# EAGLE design CANode (EAGLE 6.3)
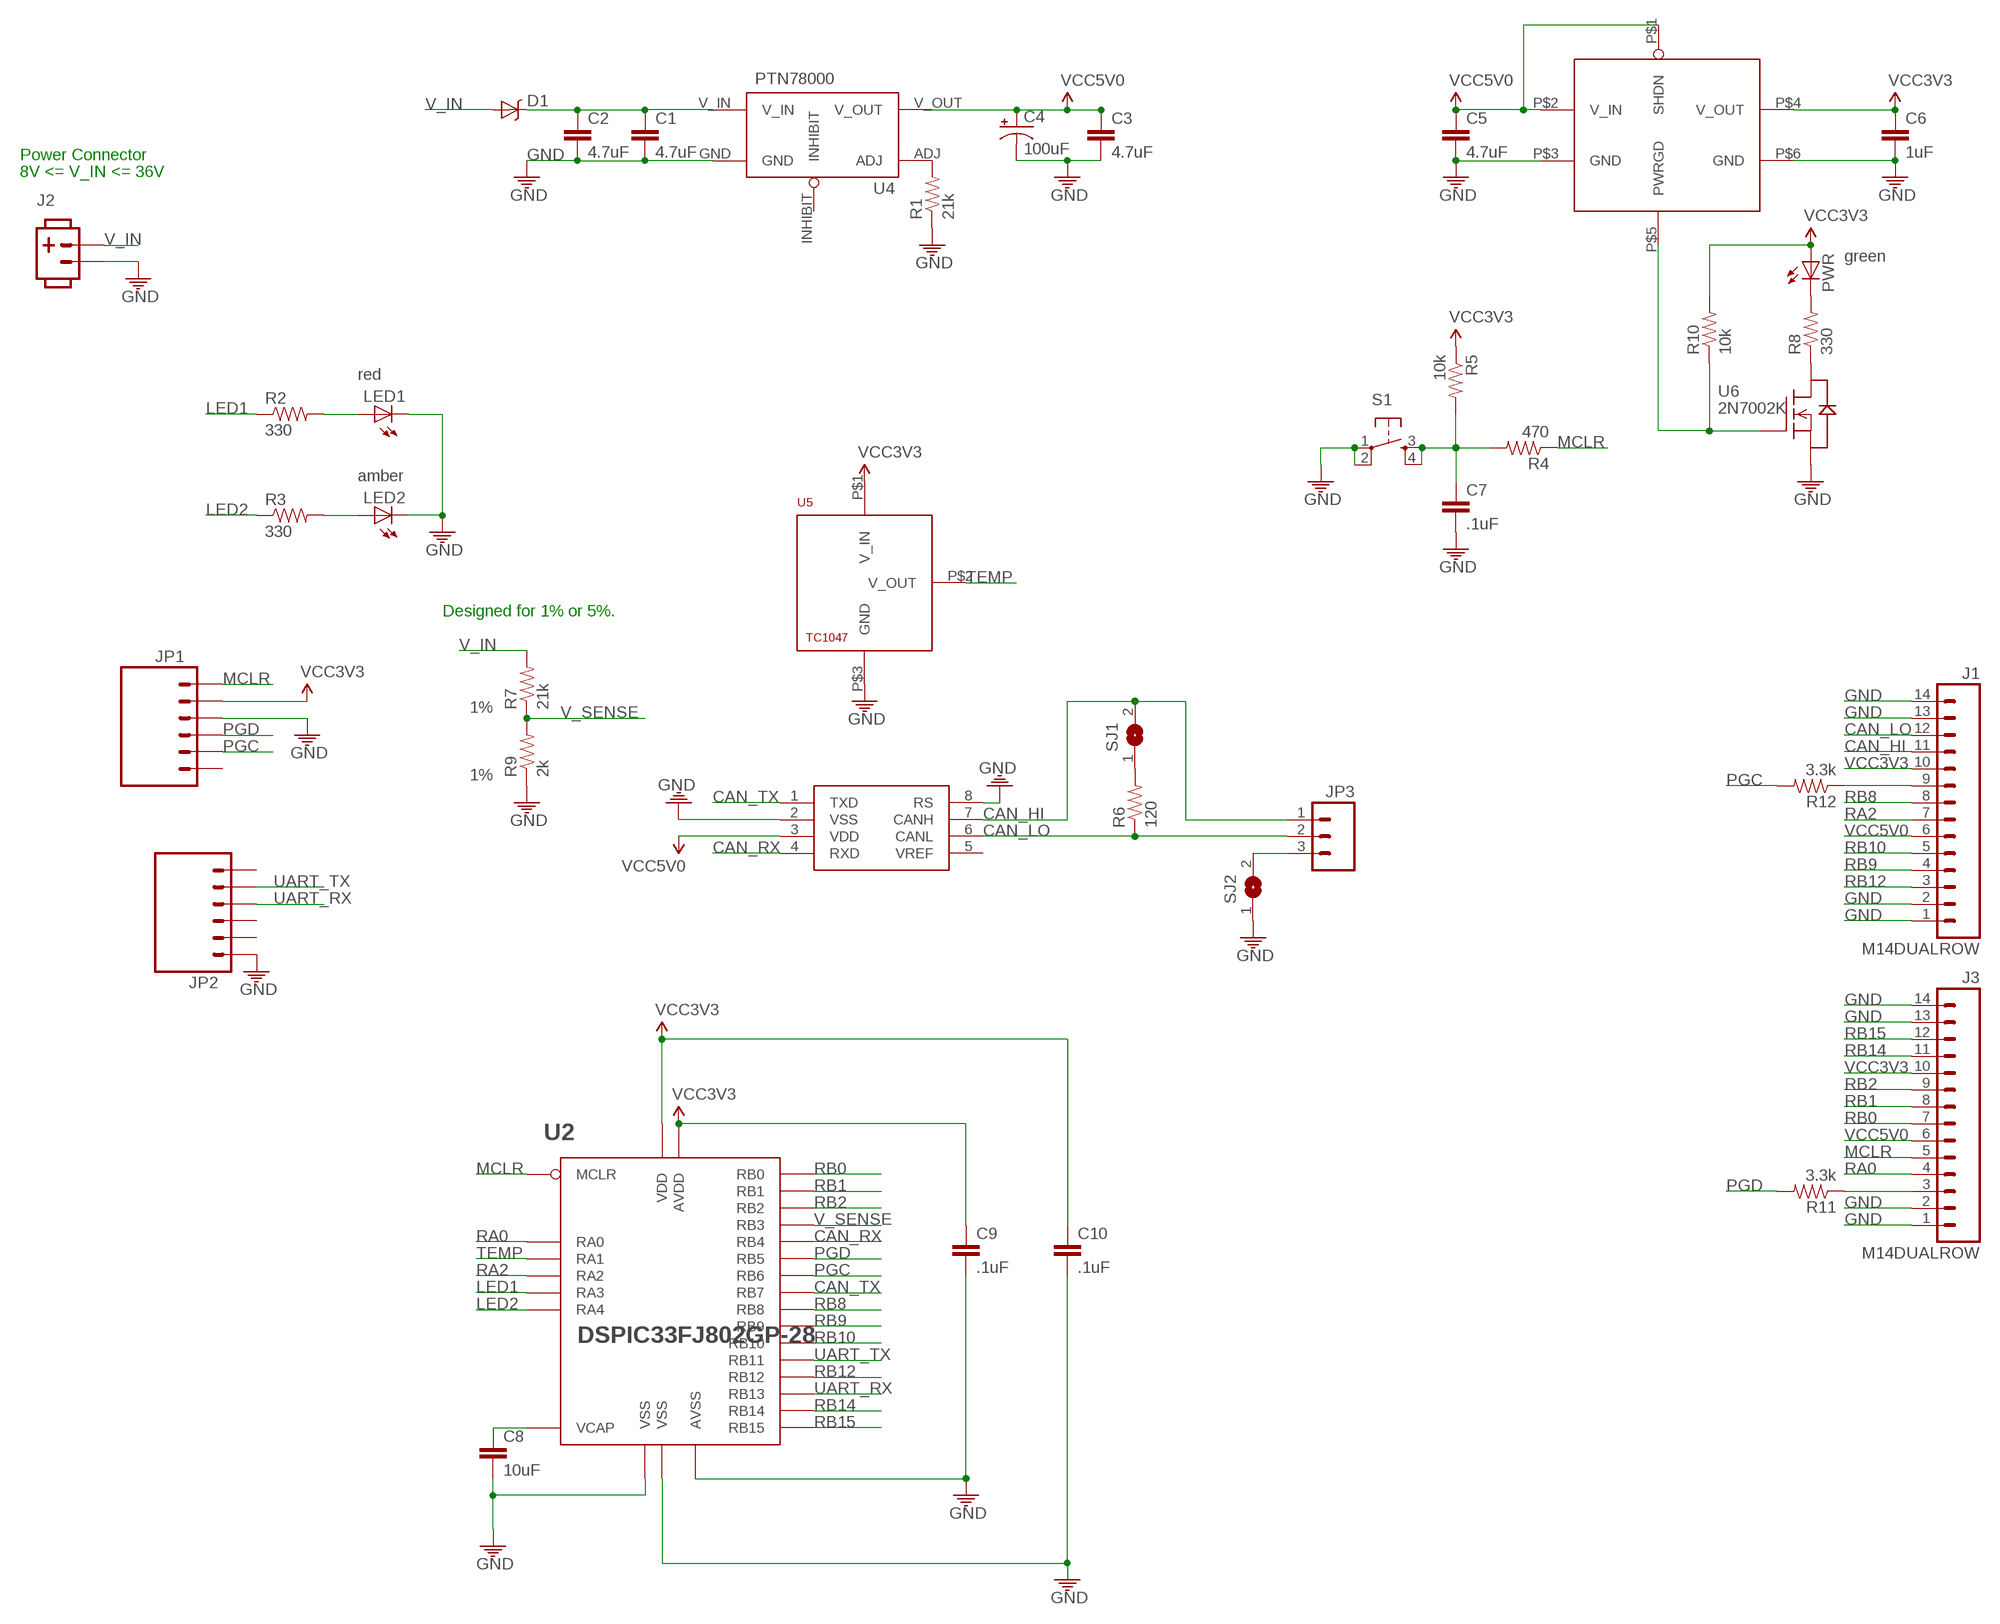
[diagram p0: schematic, sheet 1]

## Parts
C1  4.7uF  CAP1206  [1206]
C2  4.7uF  CAP1206  [1206]
C3  4.7uF  CAP1206  [1206]
C4  100uF  CAP_POLPTH1  [CPOL-RADIAL-100UF-25V]
C5  4.7uF  CAP1206  [1206]
C6  1uF  CAP1206  [1206]
C7  .1uF  CAP1206  [1206]
C8  10uF  CAP1206  [1206]
C9  .1uF  CAP1206  [1206]
C10  .1uF  CAP1206  [1206]
D1  DIODE-SCHOTTKY240A  [SMA-DIODE-B240A]
J1  M14DUALROW  [2X7]
J2  POW_CONNECTMALE-RA  [SOCKET-MALE_RA-3.96MM-2]
J3  M14DUALROW  [2X7]
JP1  M06RA_LOCK  [MOLEX-1X6-RA_LOCK]
JP2  M06LOCK  [1X06_LOCK]
JP3  M03LOCK  [1X03_LOCK]
LED1  LED1206  [LED-1206]
LED2  LED1206  [LED-1206]
PWR  LED1206  [LED-1206]
R1  21k  RESISTOR0805-RES  [0805]
R2  330  RESISTOR0805-RES  [0805]
R3  330  RESISTOR0805-RES  [0805]
R4  470  RESISTOR0805-RES  [0805]
R5  10k  RESISTOR0805-RES  [0805]
R6  120  RESISTOR0805-RES  [0805]
R7  21k  RESISTOR0805-RES  [0805]
R8  330  RESISTOR0805-RES  [0805]
R9  2k  RESISTOR0805-RES  [0805]
R10  10k  RESISTOR0805-RES  [0805]
R11  3.3k  RESISTOR0805-RES  [0805]
R12  3.3k  RESISTOR0805-RES  [0805]
S1  TAC_SWITCHPTH  [B3F-1020]
SJ1  SJ  [SJ]
SJ2  SJ  [SJ]
U1  MCP2551  [SO08]
U2  DSPIC33FJ802GP-28  [SOIC28-W]
U3  MCP1826  [SOT223-5]
U4  PTN78000  PTN78000THROUGH-HOLE  [PTN78000]
U5  TC1047  [SOT-23B]
U6  2N7002K  [SOT23-3]

## Nets
CAN_HI [small]: J1.11 JP3.1 SJ1.2 U1.7(CANH)
CAN_LO [small]: J1.12 JP3.2 R6.1 U1.6(CANL)
CAN_RX: U1.4(RXD) U2.P$11(RB4)
CAN_TX [small]: U1.1(TXD) U2.P$16(RB7)
GND [power]: C1.2 C2.2 C3.2 C4.2(-) C5.2 C6.2 C7.2 C8.2 C9.2 C10.2 J1.1 J1.2 J1.13 J1.14 J2.2 J3.1 J3.2 J3.13 J3.14 JP1.3 JP2.1 LED1.C LED2.C R1.1 R9.1 S1.1 S1.2 SJ2.1 U1.2(VSS) U1.8(RS) U2.P$8(VSS) U2.P$19(VSS) U2.P$27(AVSS) U3.P$3(GND) U3.P$6(GND) U4.GND U5.P$3(GND) U6.2(S)
LED1: R2.1 U2.P$10(RA3)
LED2: R3.1 U2.P$12(RA4)
MCLR [small]: J3.5 JP1.1 R4.1 U2.P$1(MCLR)
N$1 [small]: LED1.A R2.2
N$2: R1.2 U4.ADJ
N$3 [small]: LED2.A R3.2
N$4: R8.1 U6.3(D)
N$5 [power_in]: C1.1 C2.1 D1.C U4.V_IN
N$6 [power]: C7.1 R4.2 R5.2 S1.3 S1.4
N$7: C8.1 U2.P$20(VCAP)
N$8: PWR.C R8.2
N$9: R10.1 U3.P$5(PWRGD) U6.1(G)
N$10: R6.2 SJ1.1
N$11 [small]: J3.3 R11.1
N$12: JP3.3 SJ2.2
N$13 [small]: J1.9 R12.1
PGC [small]: JP1.5 R12.2 U2.P$15(RB6)
PGD [small]: JP1.4 R11.2 U2.P$14(RB5)
RA0: J3.4 U2.P$2(RA0)
RA2 [small]: J1.7 U2.P$9(RA2)
RB0 [small]: J3.7 U2.P$4(RB0)
RB1 [small]: J3.8 U2.P$5(RB1)
RB2 [small]: J3.9 U2.P$6(RB2)
RB8 [small]: J1.8 U2.P$17(RB8)
RB9: J1.4 U2.P$18(RB9)
RB10 [small]: J1.5 U2.P$21(RB10)
RB12 [small]: J1.3 U2.P$23(RB12)
RB14 [small]: J3.11 U2.P$25(RB14)
RB15 [small]: J3.12 U2.P$26(RB15)
TEMP: U2.P$3(RA1) U5.P$2(V_OUT)
UART_RX: JP2.4 U2.P$24(RB13)
UART_TX: JP2.5 U2.P$22(RB11)
V_IN [power_in]: D1.A J2.1 R7.2
V_SENSE: R7.1 R9.2 U2.P$7(RB3)
VCC3V3 [power]: C6.1 C9.1 C10.1 J1.10 J3.10 JP1.2 PWR.A R5.1 R10.2 U2.P$13(VDD) U2.P$28(AVDD) U3.P$4(V_OUT) U5.P$1(V_IN)
VCC5V0 [power]: C3.1 C4.1(+) C5.1 J1.6 J3.6 U1.3(VDD) U3.P$1(SHDN) U3.P$2(V_IN) U4.V_OUT
Unconnected: JP1.6 JP2.2 JP2.3 JP2.6 U1.5(VREF) U4.INHIBIT

## Notes on the sheet
- Power Connector
- 8V <= V_IN <= 36V
- Designed for 1% or 5%.

## Library data of the parts
C1-C3 C5-C10 = CMPE118lib:CAP: Capacitor Standard 0603 ceramic capacitor, and 0.1" leaded capacitor.
C4 = ASL:CAP_POL: Capacitor Polarized These are standard SMD and PTH capacitors. Normally 10uF, 47uF, and 100uF in electrolytic and tantalum varieties. Always verify the external diameter of the through hole cap, it varies with capacity, voltage, and manufacturer. The EIA devices should be standard.
D1 = CMPE118lib:DIODE-SCHOTTKY
J1 J3 = CMPE118lib:M14: Header 14 Standard 14-pin 0.1" header. Use with straight break away headers (SKU : PRT-00116), right angle break away headers (PRT-00553), swiss pins (PRT-00743), machine pins (PRT-00117), and female headers (PRT-00115).
J2 = ASL:POW_CONNECT
JP1 = ASL:M06: Header 6 Standard 6-pin 0.1" header. Use with straight break away headers (SKU : PRT-00116), right angle break away headers (PRT-00553), swiss pins (PRT-00743), machine pins (PRT-00117), and female headers (PRT-00115). Molex polarized connector foot print use with SKU : PRT-08094 with associated crimp pins and housings. NOTES ON THE VARIANTS LOCK and LOCK_LONGPADS... This footprint was designed to help hold the alignment of a through-hole component (i.e. 6-pin header) while soldering it into place. You may notice that each hole has been shifted either up or down by 0.005 of an inch from it's more standard position (which is a perfectly straight line). This slight alteration caused the pins (the squares in the middle) to touch the edges of the holes. Because they are alternating, it causes a "brace" to hold the component in place. 0.005 has proven to be the perfect amount of "off-center" position when using our standard breakaway headers. Although looks a little odd when you look at the bare footprint, once you have a header in there, the alteration is very hard to notice. Also, if you push a header all the way into place, it is covered up entirely on the bottom side. This idea of altering the position of holes to aid alignment will be further integrated into the Sparkfun Library for other footprints. It can help hold any component with 3 or more connection pins.
JP2 = CMPE118lib:M06: Header 6 Standard 6-pin 0.1" header. Use with straight break away headers (SKU : PRT-00116), right angle break away headers (PRT-00553), swiss pins (PRT-00743), machine pins (PRT-00117), and female headers (PRT-00115). Molex polarized connector foot print use with SKU : PRT-08094 with associated crimp pins and housings. NOTES ON THE VARIANTS LOCK and LOCK_LONGPADS... This footprint was designed to help hold the alignment of a through-hole component (i.e. 6-pin header) while soldering it into place. You may notice that each hole has been shifted either up or down by 0.005 of an inch from it's more standard position (which is a perfectly straight line). This slight alteration caused the pins (the squares in the middle) to touch the edges of the holes. Because they are alternating, it causes a "brace" to hold the component in place. 0.005 has proven to be the perfect amount of "off-center" position when using our standard breakaway headers. Although looks a little odd when you look at the bare footprint, once you have a header in there, the alteration is very hard to notice. Also, if you push a header all the way into place, it is covered up entirely on the bottom side. This idea of altering the position of holes to aid alignment will be further integrated into the Sparkfun Library for other footprints. It can help hold any component with 3 or more connection pins.
JP3 = CMPE118lib:M03: Header 3 Standard 3-pin 0.1" header. Use with straight break away headers (SKU : PRT-00116), right angle break away headers (PRT-00553), swiss pins (PRT-00743), machine pins (PRT-00117), and female headers (PRT-00115). Molex polarized connector foot print use with SKU : PRT-08232 with associated crimp pins and housings.
LED1 = CMPE118lib:LED: LEDs Standard schematic elements and footprints for 5mm, 3mm, 1206, and 0603 sized LEDs. 5mm - Spark Fun Electronics SKU : COM-00529 (and others); COLOR: red
LED2 = CMPE118lib:LED: LEDs Standard schematic elements and footprints for 5mm, 3mm, 1206, and 0603 sized LEDs. 5mm - Spark Fun Electronics SKU : COM-00529 (and others); COLOR: amber
PWR = CMPE118lib:LED: LEDs Standard schematic elements and footprints for 5mm, 3mm, 1206, and 0603 sized LEDs. 5mm - Spark Fun Electronics SKU : COM-00529 (and others); COLOR: green
R1-R6 R8 R10-R12 = CMPE118lib:RESISTOR: Resistor Basic schematic elements and footprints for 0603, 1206, and PTH resistors.
R7 R9 = CMPE118lib:RESISTOR: Resistor Basic schematic elements and footprints for 0603, 1206, and PTH resistors.; PRECISION: 1%
S1 = ASL:TAC_SWITCH: Momentary Switch Button commonly used for reset or general input. Spark Fun Electronics SKU : COM-00097
SJ1 SJ2 = jumper:SJ: SMD solder JUMPER
U1 = SparkFun:MCP2551
U2 = CMPE118lib:DSPIC33FJ*802GP-28: dspic33fj*802gp 28pin
U3 = CMPE118lib:MCP1826
U4 = CMPE118lib:PTN78000: This is the PTN78000 part by Texas Instruments. It's a 1.5A adjustable switching regulator.
U5 = CMPE118lib:TC1047: The TC1047 is a linear output temperature sensor whose output voltage is directly proportional to measured temperature. The TC1047 can accurately measure temperature from -40C to +125C. For the TC1047, the output voltage range is typically 100mV at -40C, 500mV at 0C, 750mV at +25C, and 1.75V at +125C. A 10mV/¢XC voltage slope allows for the wide temperature range. The TC1047 is packaged in space saving 3-Pin SOT-23B packages, making them ideal for space critical applications.
U6 = CMPE118lib:2N7002K: 60V N-channel MOSFET

## Net classes
0 default: width 0.406 mm
1 power: width 0.762 mm, clearance 0.254 mm to class 0, clearance 0.508 mm
2 small: width 0.203 mm, clearance 0.254 mm to class 1
3 power_in: width 0.762 mm, clearance 0.762 mm to class 1, clearance 0.762 mm

## Board
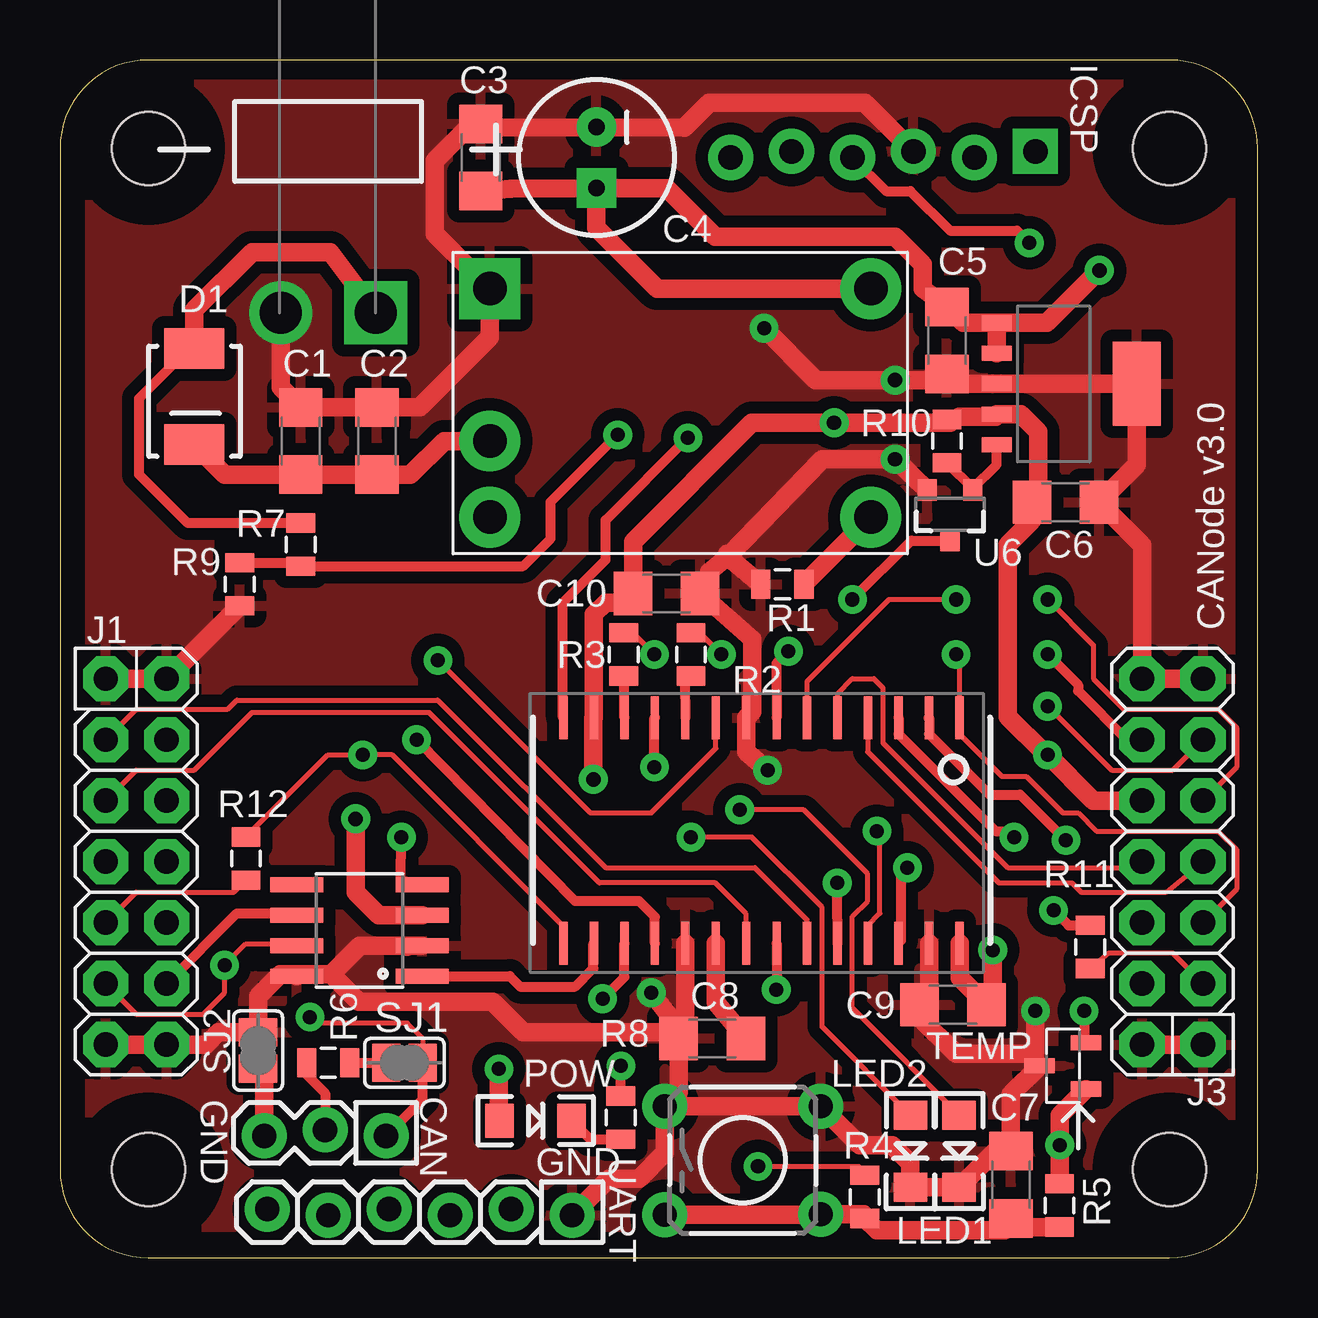
[diagram p1: board, top side]
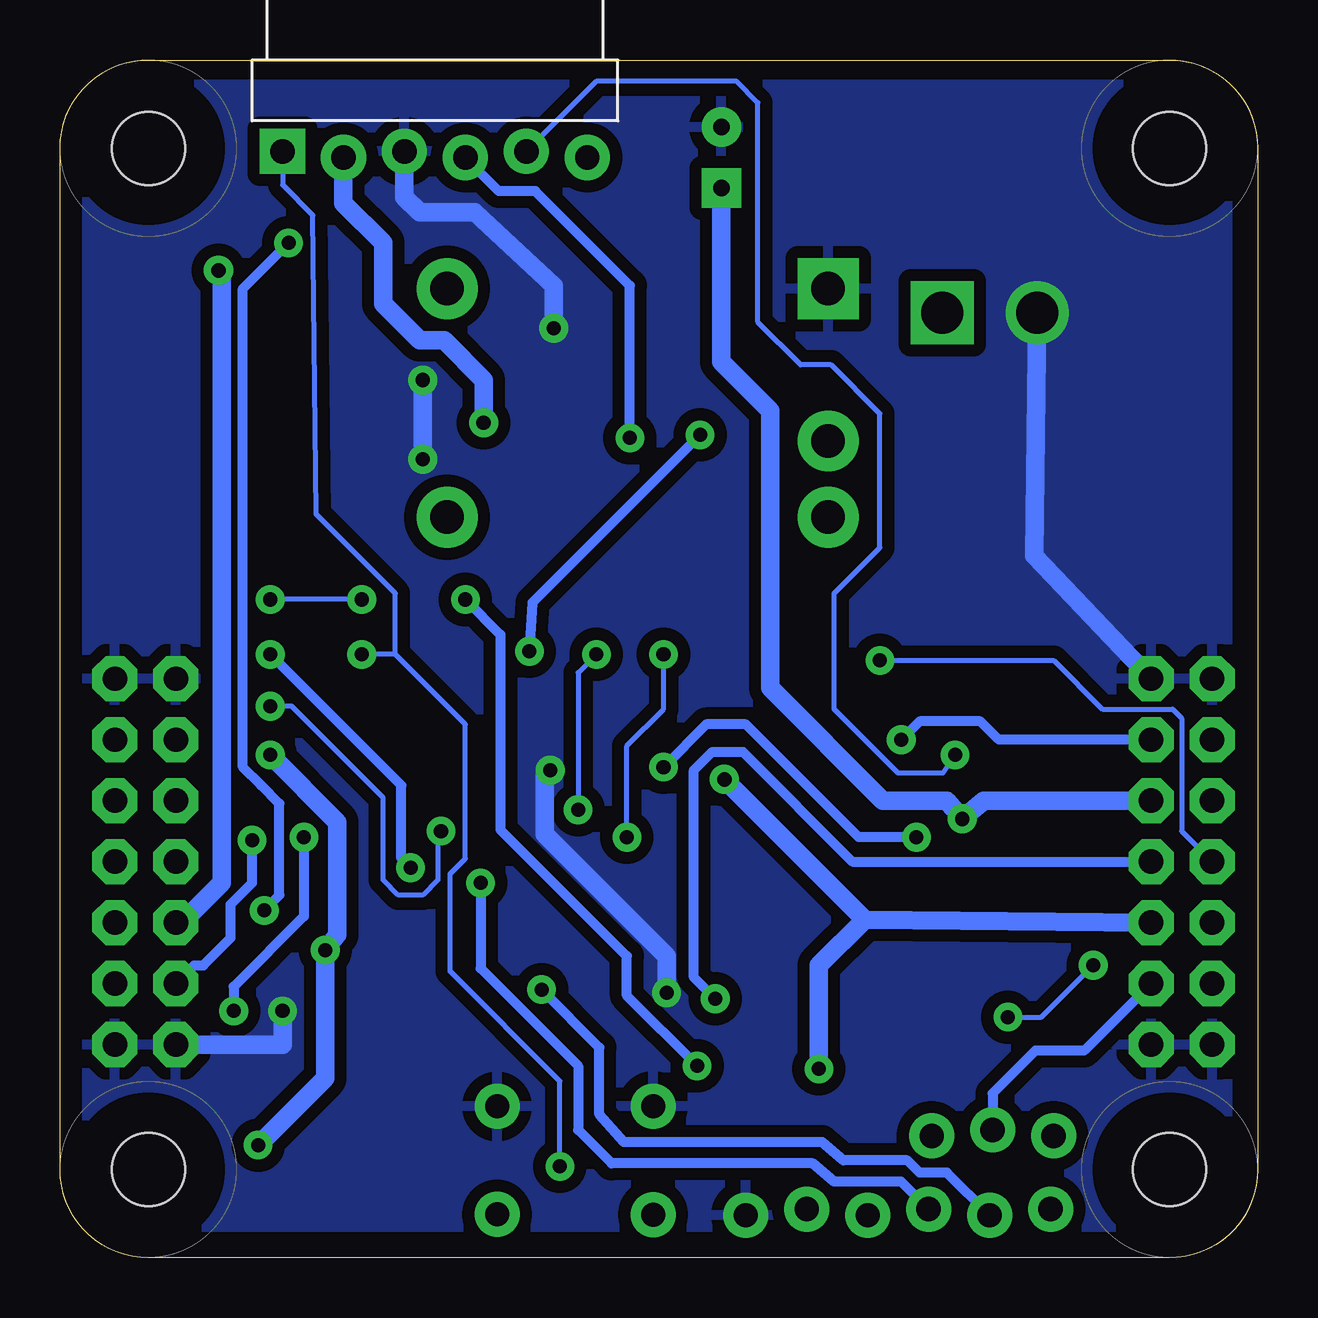
[diagram p2: board, bottom side, seen from below]

Size 49.91 x 49.91 mm. Coordinates in mm from the lower left corner, seen from the top.
Outline: 49.91,3.68 49.91,46.23 arc90 46.23,49.91 3.68,49.91 arc90 0,46.23 0,3.68 arc90 3.68,0 46.23,0 arc90 49.91,3.68
Copper layers (1*16): Top 0.035mm / dielectric 1.5mm / Bottom 0.035mm
Design rules "default *": minimum track width 8mil, minimum drill 23mil, track to track 10mil, track to pad 10mil, pad to pad 10mil, via to via 8mil, smd to smd 8mil, copper to edge 30mil, drill to drill 8mil, minimum pad ring 12mil, minimum via ring 12mil, stop-mask expansion 4mil, vias tented up to drill 0mil, thermal gap 20mil

### Footprints (pad centres in the part's own frame; a part is rotated, then mirrored left to right if it is on the bottom)
1206 = smd 1.6 x 1.8: 1 -1.4,0; 2 1.4,0
CPOL-RADIAL-100UF-25V = drill 0.7 pad 1.651 square: 1 1.27,0 | drill 0.7 pad 1.651: 2 -1.27,0
SMA-DIODE-B240A = smd 1.7 x 2.5: A 0,0; C 4,0
2X7 = drill 1.016 pad 1.88 octagon: 1 0,0; 2 0,2.54; 3 2.54,0; 4 2.54,2.54; 5 5.08,0; 6 5.08,2.54; 7 7.62,0; 8 7.62,2.54; 9 10.16,0; 10 10.16,2.54; 11 12.7,0; 12 12.7,2.54; 13 15.24,0; 14 15.24,2.54
SOCKET-MALE_RA-3.96MM-2 = drill 1.75 square: 1 -1.98,3.81 | drill 1.75: 2 1.98,3.81
MOLEX-1X6-RA_LOCK = drill 1.016 pad 1.88 square: 1 0,0.127 | drill 1.016 pad 1.88: 2 2.54,-0.127; 3 5.08,0.127; 4 7.62,-0.127; 5 10.16,0.127; 6 12.7,-0.127
1X06_LOCK = drill 1.016 pad 1.88: 1 0,0.127; 2 2.54,-0.127; 3 5.08,0.127; 4 7.62,-0.127; 5 10.16,0.127; 6 12.7,-0.127
1X03_LOCK = drill 1.016 pad 1.88: 1 0,0.127; 2 2.54,-0.127; 3 5.08,0.127
STAND-OFF-TIGHT = hole 3.048: 0,0
LED-1206 = smd 1.2 x 1.4: A -1.5,0; C 1.5,0
0805 = smd 0.8 x 1.2: 1 -0.9,0; 2 0.9,0
B3F-1020 = drill 1 pad 1.88: 1 -3.25,2.261; 2 3.25,2.25; 3 -3.25,-2.261; 4 3.25,-2.25
SJ = smd 1.168 x 1.6: 1 -0.762,0; 2 0.762,0
SO08 = smd 0.61 x 2.21: 1 -1.905,-2.616; 2 -0.635,-2.616; 3 0.635,-2.616; 4 1.905,-2.616; 5 1.905,2.616; 6 0.635,2.616; 7 -0.635,2.616; 8 -1.905,2.616
SOIC28-W = smd 1.8 x 0.35: P$1 -4.6,8.4; P$2 -4.6,7.13; P$3 -4.6,5.86; P$4 -4.6,4.59; P$5 -4.6,3.32; P$6 -4.6,2.05; P$7 -4.6,0.78; P$8 -4.6,-0.49; P$9 -4.6,-1.76; P$10 -4.6,-3.03; P$11 -4.6,-4.3; P$12 -4.6,-5.57; P$13 -4.6,-6.84; P$14 -4.6,-8.11; P$15 4.8,-8.11; P$16 4.8,-6.84; P$17 4.8,-5.57; P$18 4.8,-4.3; P$19 4.8,-3.03; P$20 4.8,-1.76; P$21 4.8,-0.49; P$22 4.8,0.78; P$23 4.8,2.05; P$24 4.8,3.32; P$25 4.8,4.59; P$26 4.8,5.86; P$27 4.8,7.13; P$28 4.8,8.4
SOT223-5 = smd 0.635 x 1.27: P$1 -2.54,-2.625; P$2 -1.27,-2.625; P$3 0,-2.625; P$4 1.27,-2.625; P$5 2.54,-2.625 | smd 3.5 x 2: P$6 0,3.2
PTN78000 = drill 1.397 pad 2.54: ADJ 15.875,-9.525; INHIBIT 0,-9.525; V_IN 0,-6.35; V_OUT 15.875,0 | drill 1.397 pad 2.54 square: GND 0,0
SOT-23B = smd 1.27 x 0.635: P$1 0.965,-0.965; P$2 0.965,0.965; P$3 -0.965,0
SOT23-3 = smd 0.8 x 0.9: 1 -0.95,-1; 2 0.95,-1; 3 0,1.1

### Placement (x,y rotation side)
C1  10.03,34.04 90 top
C2  13.21,34.04 90 top
C3  17.53,45.85 90 top
C4  22.35,45.85 270 top
C5  36.96,38.23 270 top
C6  41.9,31.48 0 top
C7  39.62,3.05 90 top
C8  27.18,9.14 180 top
C9  37.21,10.54 180 top
C10  25.27,27.69 0 top
D1  5.6,37.89 270 top
J1  1.91,24.13 270 top
J2  11.18,43.18 180 top
J3  47.62,8.89 90 top
JP1  40.64,45.97 0 bottom
JP2  21.34,1.91 180 top
JP3  13.59,5.21 180 top
JP4  STAND-OFFTIGHT  [STAND-OFF-TIGHT]  3.68,46.23 0 top
JP5  STAND-OFFTIGHT  [STAND-OFF-TIGHT]  46.23,46.23 0 top
JP6  STAND-OFFTIGHT  [STAND-OFF-TIGHT]  3.68,3.68 0 top
JP7  STAND-OFFTIGHT  [STAND-OFF-TIGHT]  46.23,3.68 0 top
LED1  37.47,4.45 270 top
LED2  35.43,4.45 270 top
PWR  19.81,5.71 0 top
R1  30.1,28.07 0 top
R2  26.29,25.15 90 top
R3  23.5,25.15 90 top
R4  33.53,2.54 270 top
R5  41.65,2.19 270 top
R6  11.18,8.13 0 top
R7  10.03,29.72 90 top
R8  23.37,5.84 270 top
R9  7.49,28.07 90 top
R10  36.96,34.04 90 top
R11  42.93,12.95 90 top
R12  7.75,16.64 90 top
S1  28.45,4.06 0 top
SJ1  14.35,8.13 0 top
SJ2  8.26,8.64 270 top
U1  12.47,13.64 90 top
U2  29.08,17.91 270 top
U3  41.66,36.42 270 top
U4  17.91,40.39 0 top
U5  41.78,8 0 top
U6  37.08,30.99 180 top

### Tracks (layer width: path | path; a pad name or v marks a point on that pad's centre or on a via)
CAN_HI  (via drill 0.58)
  Top 0.203: J1.11 3.17,10.16 5.97,10.16 6.86,11.05 v6.86,12.19 7.75,13.08 9.02,13.08 U1.7 | v10.41,10.03 10.67,9.78 14.48,9.78 15.11,9.14 15.11,8.64 | 15.24,8.64 15.24,8.26 SJ1.2
  Top 0.406: JP3.1 15.11,6.6 SJ1.2 | 15.24,8.64 15.11,8.64
  Bottom 0.203: v10.41,10.03 9.02,10.03 v6.86,12.19
CAN_LO
  Top 0.406: J1.12 7.37,14.35 9.02,14.35 U1.6 | R6.1 10.28,7.63 11.05,6.86 JP3.2
  Bottom 0.406: J1.12 7.24,8.64 9.27,8.64 11.05,6.86 JP3.2
CAN_RX  (via drill 0.58)
  Top 0.406: U1.4 14.2,15.72 v14.22,17.53 | v24.77,20.45 24.77,22.49 U2.P$11
  Bottom 0.406: v14.22,17.53 16.64,17.53 21.34,22.23 22.99,22.23 v24.77,20.45
CAN_TX
  Top 0.203: 22.23,13.09 U2.P$16
  Top 0.406: U1.1 18.75,11.73 19.18,11.3 21.46,11.3 22.23,12.06 22.23,13.09
GND  (via drill 0.58, 0.6)
  Top 0.762: J2.2 9.2,36.27 C1.2 C2.2 14.99,35.44 17.91,38.35 U4.GND 15.62,42.67 15.62,45.72 17.14,47.24 17.4,47.24 C3.2 | J3.13 J3.14 45.09,29.7 C6.2 44.86,33.04 U3.P$6 U3.P$3 36.93,36.42 C5.2 36.71,36.57 v34.8,36.58 31.5,36.58 v29.34,38.73 | U2.P$27 36.21,10.94 C9.2 35.81,10.04 37.34,8.51 40.31,8.51 U5.P$3 | C8.2 26.05,10.18 U2.P$19 | 11.3,11.81 12.5,13.01 U1.2 14.43,13.01 14.48,12.95 | 11.3,11.81 9.78,11.81 | 11.3,11.81 12.45,10.67 18.03,10.67 19.3,9.4 25.52,9.4 C8.2 | J1.13 J1.14 6.1,8.89 6.6,9.4 SJ2.1 8.26,10.9 9.17,11.81 9.78,11.81 | U6.2 v34.8,33.27 31.75,33.27 27.81,29.21 | J3.2 J3.1 | J1.1 J1.2 5.71,25.4 R9.1 | v24.64,11.05 25.52,9.91 C8.2 | v29.48,20.32 28.59,21.08 U2.P$8 28.85,22.76 28.85,25.77 C10.2 27.05,28.07 27.05,28.58 27.81,29.21 | 17.4,47.25 C3.2 | C3.2 17.5,47.09 C4.2 26.01,47.09 27.05,48.13 33.53,48.13 JP1.3 | R1.1 27.81,29.21 | 27.8,29.34 27.81,29.21 | v40.64,10.29 40.64,8.13 U5.P$3 | 9.78,11.81 U1.8 | U5.P$3 39.62,6.81 C7.2 38.97,4.45 LED1.C LED2.C 35.43,3.94 34.67,4.7 33.31,4.7 S1.2 S1.1 | 25.2,5.64 S1.1 | C8.2 25.78,6.91 S1.1 | JP2.1 22.86,3.3 24.13,3.3 25.2,4.37 S1.1
  Bottom 0.762: v34.8,33.27 v34.8,36.58 | J1.2 9.32,29.26 J2.2 | J3.2 40.64,8.89 v40.64,10.29 | v29.48,20.32 29.72,20.08 29.72,17.65 24.64,12.57 v24.64,11.05 | v29.34,38.73 29.34,40.51 32.64,43.56 34.92,43.56 35.56,44.2 JP1.3
  pour Top: 1.27,1.27 1.27,48.9 48.77,48.9 48.77,1.27
  pour Bottom: 1.27,1.27 48.77,1.27 48.77,48.9 1.27,48.9
LED1
  Top 0.406: R2.1 26.04,24.05 U2.P$10
LED2
  Top 0.406: U2.P$12 23.51,24.23 R3.1
MCLR  (via drill 0.58)
  Top 0.203: v37.34,25.15 37.48,25 U2.P$1 37.48,21.83 39.24,20.07 40.26,20.07 41.78,18.54 42.42,18.54 43.18,17.78 48.26,17.78 49.02,17.02 49.02,15.37 J3.5 | v29.08,3.81 33.28,3.81 R4.1
  Bottom 0.203: 37.08,25.15 v37.34,25.15 35.94,25.15 | v29.08,3.81 29.08,7.37 33.66,11.94 33.66,16 33.02,16.64 33.02,22.23 35.94,25.15 | 35.94,25.15 35.94,27.69 39.24,30.99 39.37,43.43 40.64,44.7 JP1.1
N$1  (via drill 0.58)
  Top 0.203: v28.32,18.67 30.99,18.67 33.66,16 33.66,14.86 33.02,14.22 33.02,10.41 35.31,8.13 35.54,7.87 LED1.A | R2.2 26.66,26.05 v27.56,25.15
  Bottom 0.203: v27.56,25.15 28.32,24.38 v28.32,18.67
N$2
  Top 0.762: R1.2 U4.ADJ
N$3  (via drill 0.58)
  Top 0.203: v26.29,17.53 28.83,17.53 31.75,14.61 31.75,9.63 LED2.A | v24.77,25.15 23.86,26.05 R3.2
  Bottom 0.203: v26.29,17.53 26.29,21.34 24.77,22.86 v24.77,25.15
N$4  (via drill 0.58)
  Top 0.406: R8.1 v23.37,8 | v33.02,27.43 35.48,29.89 U6.3
  Bottom 0.406: v23.37,8 26.29,10.92 26.29,12.57 31.56,17.84 31.56,25.97 v33.02,27.43
N$5
  Top 0.762: D1.C 6.86,32.64 C1.1 C2.1 14.6,32.64 16,34.04 U4.V_IN
N$6
  Top 0.762: R5.2 40.27,1.27 C7.1 39.75,1.52 39.37,1.14 34.02,1.14 R4.2 33.48,1.81 S1.4 31.69,1.8 S1.3
N$7
  Top 0.762: U2.P$20 27.32,10.65 C8.1
N$8
  Top 0.406: PWR.C 22.09,4.94 R8.2
N$9
  Top 0.406: R10.1 38.03,32.06 | 38.03,32.06 U6.1 | 38.03,32.06 39.03,33.06 U3.P$5
N$10
  Top 0.406: R6.2 SJ1.1
N$11
  Top 0.203: J3.3 46.35,12.7 43.7,12.7 R11.1
N$12
  Top 0.762: JP3.3 8.51,7.62 SJ2.2
N$13
  Top 0.203: J1.9 3.17,15.24 7.25,15.24 R12.1
PGC  (via drill 0.58)
  Top 0.203: U2.P$15 20.97,13.82 13.84,20.95 v12.62,20.95 11.16,20.95 R12.2
  Bottom 0.203: v12.62,20.95 13.12,20.19 14.99,20.19 17.65,22.86 17.65,27.69 15.75,29.59 15.75,35.18 17.78,37.21 19.05,37.21 20.83,38.99 20.83,48.13 21.72,49.02 27.56,49.02 JP1.5
PGD  (via drill 0.58)
  Top 0.203: U2.P$14 20.95,22.52
  Top 0.406: 20.95,22.52 20.95,27.3 22.73,29.08 22.73,30.73 v26.16,34.16 | v41.4,14.48 42.03,13.85 R11.2 | JP1.4 34.42,44.45 35.43,44.45 37.08,42.8 39.88,42.8 v40.39,42.29
  Bottom 0.203: 26.16,34.04 v26.16,34.16 | 41.53,19.68
  Bottom 0.406: v41.4,14.48 40.77,15.11 40.77,18.92 41.53,19.68 | 41.53,19.68 42.29,20.45 42.29,40.38 v40.39,42.29 | v26.16,34.16 26.16,40.51 30.1,44.45 31.62,44.45 JP1.4
RA0  (via drill 0.58)
  Top 0.406: 36.2,22.49 U2.P$2 36.21,21.83 38.73,19.3 40.01,19.3 v41.91,17.4
  Bottom 0.406: J3.4 44.32,12.19 43.94,12.19 42.8,13.34 42.8,14.73 41.91,15.62 v41.91,17.4
RA2  (via drill 0.58)
  Top 0.203: v15.75,24.89 22.1,18.54 24.64,18.54 27.32,21.23 U2.P$9
  Bottom 0.203: v15.75,24.89 8.51,24.89 6.48,22.86 3.56,22.86 3.17,22.48 3.17,17.78 J1.7
RB0
  Top 0.203: U2.P$4 33.66,22.48 33.66,21.08 39.12,15.62 42.16,15.62 42.55,15.24 46.1,15.24 J3.7
RB1
  Top 0.203: U2.P$5 32.4,23.51 33.02,24.13 33.91,24.13 34.29,23.75 34.29,21.46 39.5,16.26 44.7,16.26 J3.8
RB2  (via drill 0.58)
  Top 0.203: U2.P$6 31.13,24.02 34.54,27.43 v37.34,27.43 | J3.9 49.02,20.45 49.02,22.1 48.26,22.86 44.32,22.86 43.05,24.13 43.05,25.53 v41.15,27.43
  Bottom 0.203: v37.34,27.43 v41.15,27.43
RB8  (via drill 0.58)
  Top 0.203: U2.P$17 23.5,13.09
  Top 0.406: v22.61,10.79 23.51,11.7 U2.P$17
  Bottom 0.406: J1.8 16.89,16.51 21.46,21.08 22.73,21.08 23.5,20.32 23.5,11.68 v22.61,10.79
RB9  (via drill 0.58)
  Top 0.406: U2.P$18 24.78,14.21 24.13,14.86 21.46,14.86 v14.86,21.59
  Bottom 0.406: J1.4 10.79,21.59 11.56,22.35 14.1,22.35 v14.86,21.59
RB10
  Top 0.203: U2.P$21 28.59,14.33 27.3,15.62 22.48,15.62 15.37,22.73 8,22.73 5.59,20.32 3.17,20.32 J1.5
RB12
  Top 0.203: J1.3 3.17,22.86 6.99,22.86 7.37,23.24 15.74,23.24 15.94,23.04 22.73,16.26 28.96,16.26 31.11,14.1 31.11,13.12 U2.P$23
RB14  (via drill 0.58)
  Top 0.203: J3.11 46.35,20.32 43.81,20.32 v41.15,22.99 | U2.P$25 33.66,13.12 33.66,13.84 34.16,14.35 34.16,17.65 v34.04,17.78
  Bottom 0.203: v41.15,22.99 40.26,22.99 36.45,19.18 36.45,15.75 35.81,15.11 34.8,15.11 34.16,15.75 34.16,17.65 v34.04,17.78
RB15  (via drill 0.58)
  Top 0.203: U2.P$26 35.05,13.22 | 44.32,21.59 J3.12
  Top 0.406: 35.05,13.22 35.05,16 v35.31,16.26 | v41.15,25.15 42.42,23.88 42.42,23.62 44.45,21.59 J3.12
  Bottom 0.406: v41.15,25.15 35.69,19.68 35.69,16.64 v35.31,16.26
TEMP  (via drill 0.58)
  Top 0.406: v42.67,10.29 42.67,9.27 U5.P$2 | U2.P$3 34.94,21.83 38.99,17.78 39.5,17.78 v39.75,17.53
  Bottom 0.406: v39.75,17.53 39.75,14.22 42.67,11.3 v42.67,10.29
UART_RX  (via drill 0.58)
  Top 0.406: U2.P$24 32.38,15.12 v32.38,15.62
  Bottom 0.406: v32.38,15.62 32.38,12.06 28.32,8 28.32,5.33 26.92,3.94 18.54,3.94 17.65,3.17 14.86,3.17 JP2.4
UART_TX  (via drill 0.58)
  Top 0.406: U2.P$22 29.86,11.67 v29.84,11.18
  Bottom 0.406: v29.84,11.18 27.43,8.76 27.43,5.97 26.42,4.83 18.16,4.83 17.27,4.06 14.61,4.06 14.1,3.56 12.95,3.56 JP2.5
V_IN
  Top 0.406: R7.2 5.32,30.62 3.3,32.64 3.3,35.81 5.38,37.89 D1.A
  Top 0.762: D1.A 5.6,39.51 8,41.91 11.25,41.91 J2.1
V_SENSE  (via drill 0.58)
  Top 0.406: v30.35,25.27 29.84,24.77 U2.P$7 | R9.2 10.01,28.97 R7.1 19.29,28.82 20.45,29.97 20.45,31.5 v23.24,34.29
  Bottom 0.406: v23.24,34.29 30.23,27.3 v30.35,25.27
VCC3V3  (via drill 0.58, 0.6)
  Top 0.762: U2.P$28 37.48,11.67 C9.1 38.61,10.8 38.86,11.05 v38.86,12.83 38.99,12.84 | 37.08,34.8 37.47,35.05 39,35.05 U3.P$4 40.04,35.15 40.77,34.42 40.77,31.75 C6.1 40.5,30.72 39.5,29.72 39.5,22.54 41.02,21.02 v41.15,20.95 43.05,19.05 J3.10 | v22.23,19.94 22.23,22.49 U2.P$13 22.24,26.82 22.73,27.3 23.49,27.3 C10.1 23.88,29.84 28.83,34.8 v32.26,34.8 37.08,34.8 | R10.2 37.08,34.81 37.08,34.8 | PWR.A 18.29,6.37 v18.29,7.87 | R5.1 41.65,3.57 v41.66,4.7 41.66,5.94 U5.P$1
  Bottom 0.762: J1.10 16.38,14.1 | 16.38,14.1 v22.23,19.94 | 16.38,14.1 18.29,12.19 v18.29,7.87 | v41.15,20.95 38.35,18.16 38.35,13.46 v38.86,12.83 38.86,7.49 v41.66,4.7 | JP1.2 38.1,43.94 36.45,42.29 36.45,39.75 34.92,38.23 33.91,38.23 32.26,36.58 v32.26,34.8
VCC5V0  (via drill 0.6)
  Top 0.762: U4.V_OUT 24.89,40.39 22.35,42.93 C4.1 | 39.12,38.87 39.12,38.86 39.03,38.78 | 39.03,38.78 U3.P$2 | U3.P$1 39.03,38.78 | U1.3 13.28,14.28 12.32,15.24 v12.32,18.29 | C3.1 18.77,44.55 C4.1 | U3.P$1 37.63,38.96 C5.1 35.94,40.39 35.94,41.4 34.8,42.55 27.3,42.55 25.27,44.58 C4.1 | U3.P$1 41.12,38.96 v43.31,41.15
  Bottom 0.762: J3.6 44.7,14.35 44.96,13.84 43.18,15.62 43.18,41.02 v43.31,41.15 | J1.6 11.43,19.05 v12.32,18.29 12.95,19.05 15.62,19.05 20.32,23.75 20.32,35.31 22.35,37.34 C4.1

### Text on the board
tPlace: ICSP | CANode v3.0 | GND | CAN | POW | UART | GND
tNames: TEMP